# Altium schematic sheet ASIC_2.SchDoc: Title
size A2; Date: Date; CompanyName: Integrated Micro-Electronics Bulgaria; Organization: Design & Development Department; Address1: Drawing Type; Address2: Address 1; Address3: Address 2; Address4: Address 3; DocumentNumber: 730xxx; Revision: 01; SheetNumber: 1; SheetTotal: 1; PageSetup: Record=PageOptions|CenterHorizontal=True|CenterVertical=True|PrintScale=0.70|XCorrection=1.00|YCorrection=1.00|PrintKind=2|BorderSize=5000000|LeftOffset=0|BottomOffset=0|Orientation=2|PaperLength=1000|PaperWidth=1000|Scale=100|PaperSource=7|PrintQuality=-4|MediaType=1|DitherType=10|PaperKind=A4|PrintScaleMode=1; SheetSize: A3; Time: Time; ModifiedDate: Mod. Date
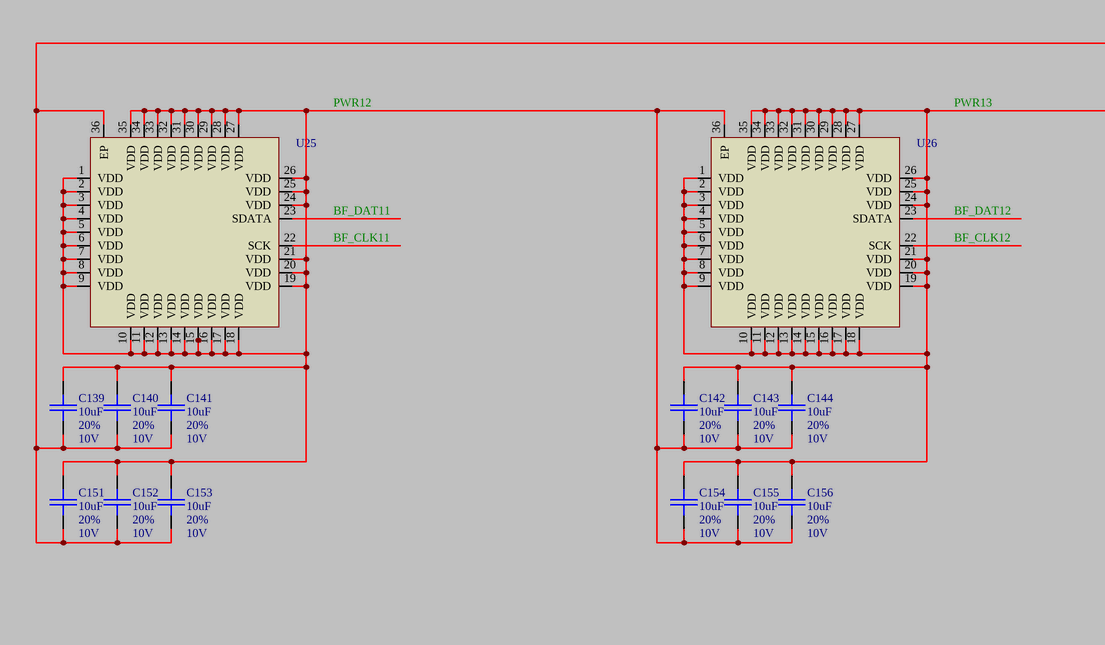
[diagram p0: ASIC_2.SchDoc, left]
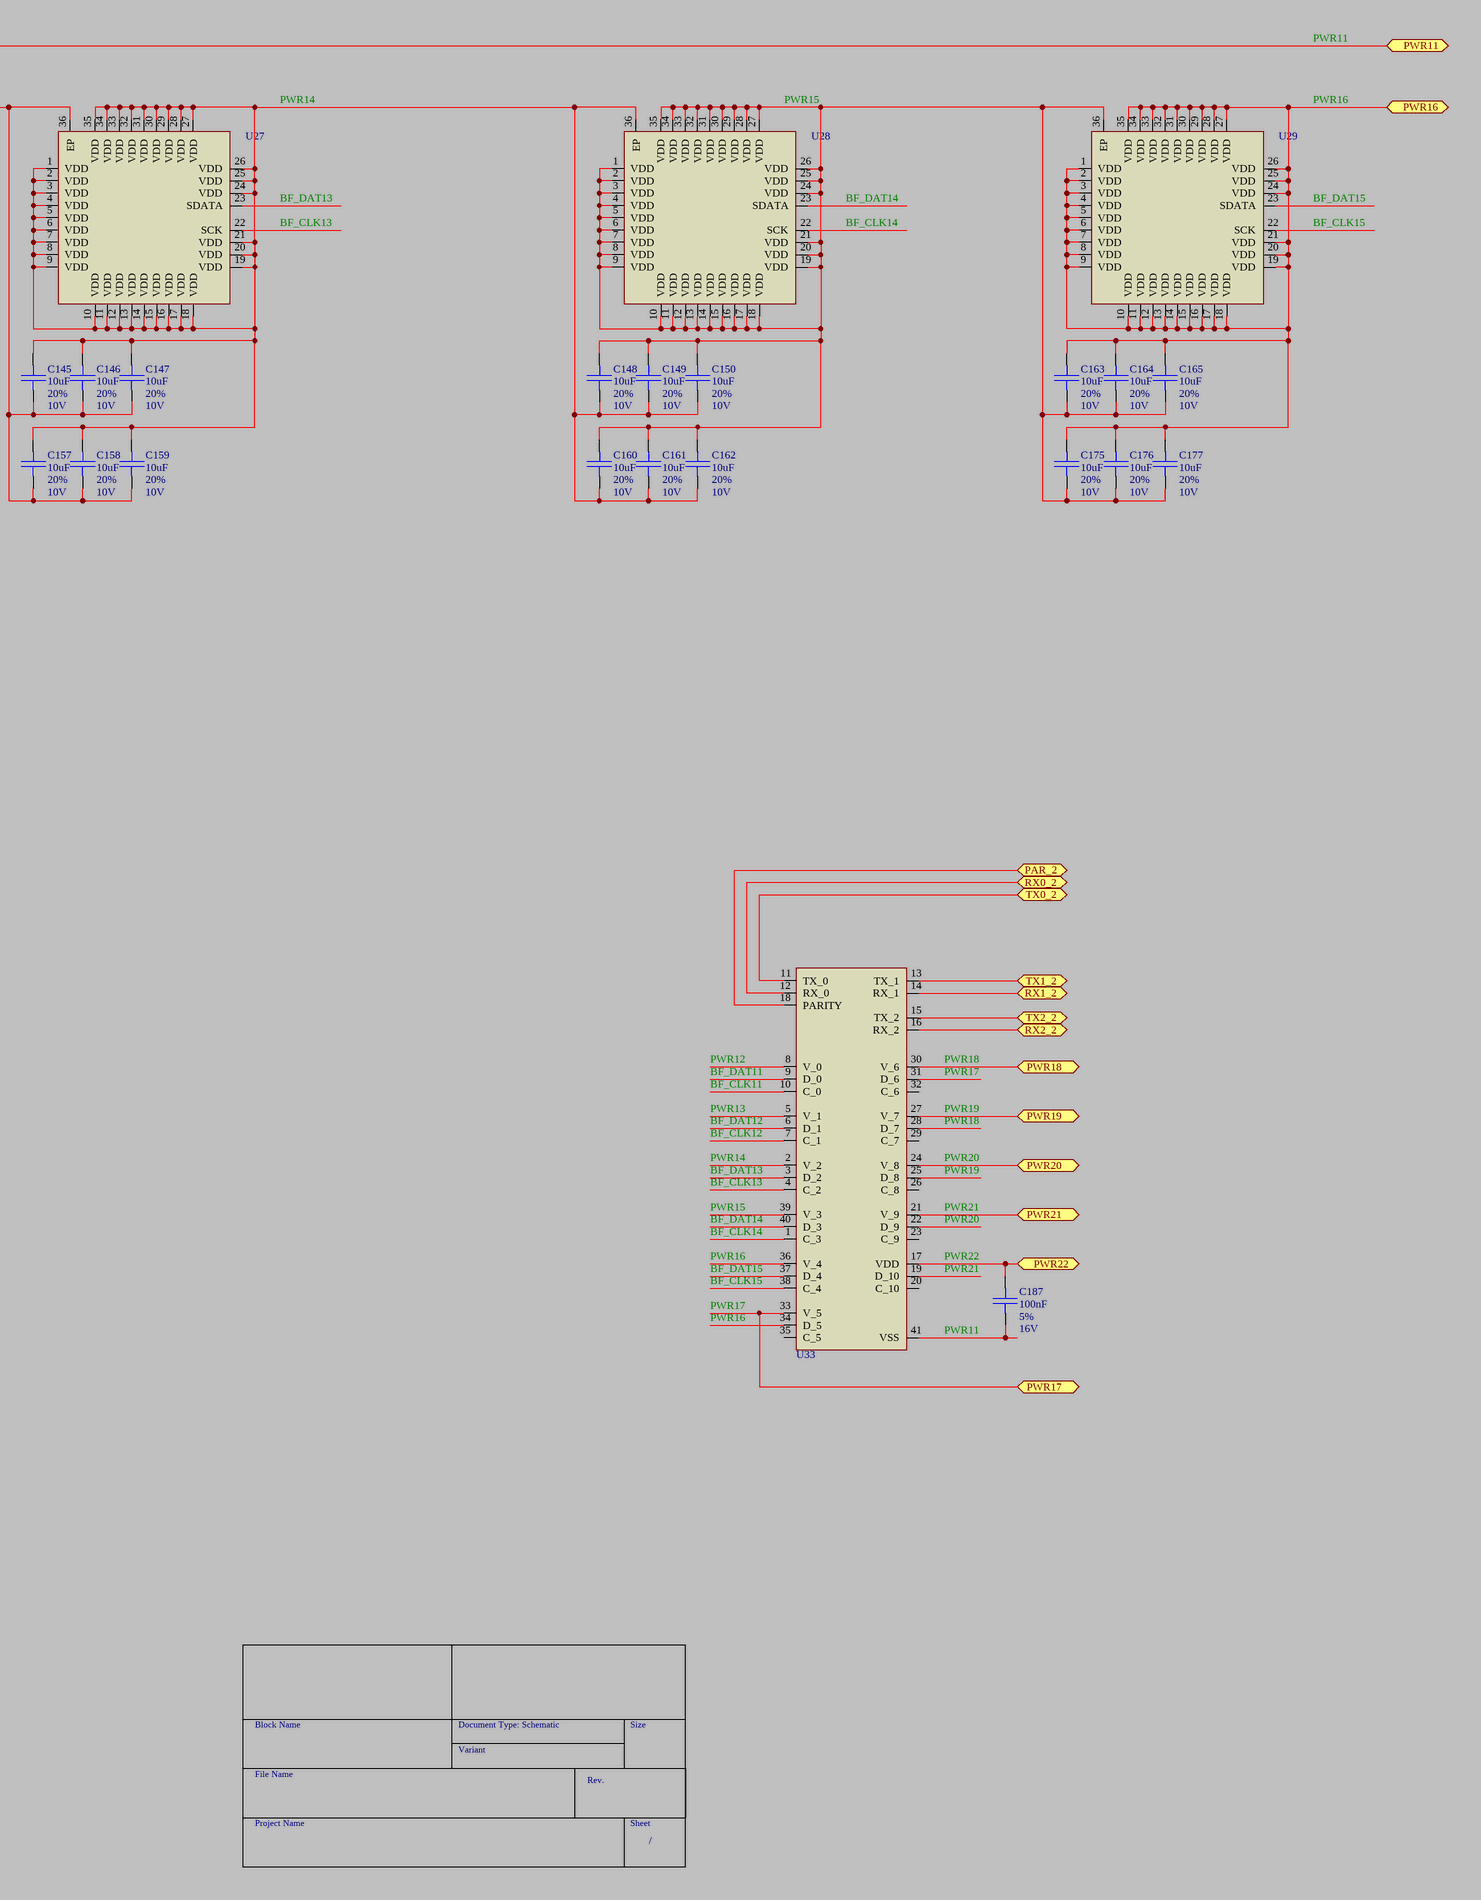
[diagram p1: ASIC_2.SchDoc, right]

## Parts
C139  DB_VALUE: 10uF  DB_TOLERANCE: 20%  DB_VOLTAGE: 10V  [SMD_0402_CAPC1005X70N]  (hidden comment: C)
C140  DB_VALUE: 10uF  DB_TOLERANCE: 20%  DB_VOLTAGE: 10V  [SMD_0402_CAPC1005X70N]  (hidden comment: C)
C141  DB_VALUE: 10uF  DB_TOLERANCE: 20%  DB_VOLTAGE: 10V  [SMD_0402_CAPC1005X70N]  (hidden comment: C)
C142  DB_VALUE: 10uF  DB_TOLERANCE: 20%  DB_VOLTAGE: 10V  [SMD_0402_CAPC1005X70N]  (hidden comment: C)
C143  DB_VALUE: 10uF  DB_TOLERANCE: 20%  DB_VOLTAGE: 10V  [SMD_0402_CAPC1005X70N]  (hidden comment: C)
C144  DB_VALUE: 10uF  DB_TOLERANCE: 20%  DB_VOLTAGE: 10V  [SMD_0402_CAPC1005X70N]  (hidden comment: C)
C145  DB_VALUE: 10uF  DB_TOLERANCE: 20%  DB_VOLTAGE: 10V  [SMD_0402_CAPC1005X70N]  (hidden comment: C)
C146  DB_VALUE: 10uF  DB_TOLERANCE: 20%  DB_VOLTAGE: 10V  [SMD_0402_CAPC1005X70N]  (hidden comment: C)
C147  DB_VALUE: 10uF  DB_TOLERANCE: 20%  DB_VOLTAGE: 10V  [SMD_0402_CAPC1005X70N]  (hidden comment: C)
C148  DB_VALUE: 10uF  DB_TOLERANCE: 20%  DB_VOLTAGE: 10V  [SMD_0402_CAPC1005X70N]  (hidden comment: C)
C149  DB_VALUE: 10uF  DB_TOLERANCE: 20%  DB_VOLTAGE: 10V  [SMD_0402_CAPC1005X70N]  (hidden comment: C)
C150  DB_VALUE: 10uF  DB_TOLERANCE: 20%  DB_VOLTAGE: 10V  [SMD_0402_CAPC1005X70N]  (hidden comment: C)
C151  DB_VALUE: 10uF  DB_TOLERANCE: 20%  DB_VOLTAGE: 10V  [SMD_0402_CAPC1005X70N]  (hidden comment: C)
C152  DB_VALUE: 10uF  DB_TOLERANCE: 20%  DB_VOLTAGE: 10V  [SMD_0402_CAPC1005X70N]  (hidden comment: C)
C153  DB_VALUE: 10uF  DB_TOLERANCE: 20%  DB_VOLTAGE: 10V  [SMD_0402_CAPC1005X70N]  (hidden comment: C)
C154  DB_VALUE: 10uF  DB_TOLERANCE: 20%  DB_VOLTAGE: 10V  [SMD_0402_CAPC1005X70N]  (hidden comment: C)
C155  DB_VALUE: 10uF  DB_TOLERANCE: 20%  DB_VOLTAGE: 10V  [SMD_0402_CAPC1005X70N]  (hidden comment: C)
C156  DB_VALUE: 10uF  DB_TOLERANCE: 20%  DB_VOLTAGE: 10V  [SMD_0402_CAPC1005X70N]  (hidden comment: C)
C157  DB_VALUE: 10uF  DB_TOLERANCE: 20%  DB_VOLTAGE: 10V  [SMD_0402_CAPC1005X70N]  (hidden comment: C)
C158  DB_VALUE: 10uF  DB_TOLERANCE: 20%  DB_VOLTAGE: 10V  [SMD_0402_CAPC1005X70N]  (hidden comment: C)
C159  DB_VALUE: 10uF  DB_TOLERANCE: 20%  DB_VOLTAGE: 10V  [SMD_0402_CAPC1005X70N]  (hidden comment: C)
C160  DB_VALUE: 10uF  DB_TOLERANCE: 20%  DB_VOLTAGE: 10V  [SMD_0402_CAPC1005X70N]  (hidden comment: C)
C161  DB_VALUE: 10uF  DB_TOLERANCE: 20%  DB_VOLTAGE: 10V  [SMD_0402_CAPC1005X70N]  (hidden comment: C)
C162  DB_VALUE: 10uF  DB_TOLERANCE: 20%  DB_VOLTAGE: 10V  [SMD_0402_CAPC1005X70N]  (hidden comment: C)
C163  DB_VALUE: 10uF  DB_TOLERANCE: 20%  DB_VOLTAGE: 10V  [SMD_0402_CAPC1005X70N]  (hidden comment: C)
C164  DB_VALUE: 10uF  DB_TOLERANCE: 20%  DB_VOLTAGE: 10V  [SMD_0402_CAPC1005X70N]  (hidden comment: C)
C165  DB_VALUE: 10uF  DB_TOLERANCE: 20%  DB_VOLTAGE: 10V  [SMD_0402_CAPC1005X70N]  (hidden comment: C)
C175  DB_VALUE: 10uF  DB_TOLERANCE: 20%  DB_VOLTAGE: 10V  [SMD_0402_CAPC1005X70N]  (hidden comment: C)
C176  DB_VALUE: 10uF  DB_TOLERANCE: 20%  DB_VOLTAGE: 10V  [SMD_0402_CAPC1005X70N]  (hidden comment: C)
C177  DB_VALUE: 10uF  DB_TOLERANCE: 20%  DB_VOLTAGE: 10V  [SMD_0402_CAPC1005X70N]  (hidden comment: C)
C187  DB_VALUE: 100nF  DB_TOLERANCE: 5%  DB_VOLTAGE: 16V  [SMD_0603_CAPC1608X95N]  (hidden comment: C)
U25  IC_BITFURY16  [SMD_QFN50P600X600X175-36AN]  (value not drawn)
U26  IC_BITFURY16  [SMD_QFN50P600X600X175-36AN]  (value not drawn)
U27  IC_BITFURY16  [SMD_QFN50P600X600X175-36AN]  (value not drawn)
U28  IC_BITFURY16  [SMD_QFN50P600X600X175-36AN]  (value not drawn)
U29  IC_BITFURY16  [SMD_QFN50P600X600X175-36AN]  (value not drawn)
U33  IC_BTC250  [SMD_QFN40P500X500X80-41N]  (value not drawn)

## Ports
PAR_2, PWR11, PWR16, PWR17, PWR18, PWR19, PWR20, PWR21, PWR22, RX0_2, RX1_2, RX2_2, TX0_2, TX1_2, TX2_2

## Nets
BF_CLK11: U25.22(SCK) U33.10(C_0)
BF_CLK12: U26.22(SCK) U33.7(C_1)
BF_CLK13: U27.22(SCK) U33.4(C_2)
BF_CLK14: U28.22(SCK) U33.1(C_3)
BF_CLK15: U29.22(SCK) U33.38(C_4)
BF_DAT11: U25.23(SDATA) U33.9(D_0)
BF_DAT12: U26.23(SDATA) U33.6(D_1)
BF_DAT13: U27.23(SDATA) U33.3(D_2)
BF_DAT14: U28.23(SDATA) U33.40(D_3)
BF_DAT15: U29.23(SDATA) U33.37(D_4)
PAR_2: U33.18(PARITY) ; port PAR_2
PWR11: C139.2 C140.2 C141.2 C151.2 C152.2 C153.2 C187.2 U25.36(EP) U33.41(VSS) ; port PWR11
PWR12: C139.1 C140.1 C141.1 C142.2 C143.2 C144.2 C151.1 C152.1 C153.1 C154.2 C155.2 C156.2 U25.1(VDD) U25.2(VDD) U25.3(VDD) U25.4(VDD) U25.5(VDD) U25.6(VDD) U25.7(VDD) U25.8(VDD) U25.9(VDD) U25.10(VDD) U25.11(VDD) U25.12(VDD) U25.13(VDD) U25.14(VDD) U25.15(VDD) U25.16(VDD) U25.17(VDD) U25.18(VDD) U25.19(VDD) U25.20(VDD) U25.21(VDD) U25.24(VDD) U25.25(VDD) U25.26(VDD) U25.27(VDD) U25.28(VDD) U25.29(VDD) U25.30(VDD) U25.31(VDD) U25.32(VDD) U25.33(VDD) U25.34(VDD) U25.35(VDD) U26.36(EP) U33.8(V_0)
PWR13: C142.1 C143.1 C144.1 C145.2 C146.2 C147.2 C154.1 C155.1 C156.1 C157.2 C158.2 C159.2 U26.1(VDD) U26.2(VDD) U26.3(VDD) U26.4(VDD) U26.5(VDD) U26.6(VDD) U26.7(VDD) U26.8(VDD) U26.9(VDD) U26.10(VDD) U26.11(VDD) U26.12(VDD) U26.13(VDD) U26.14(VDD) U26.15(VDD) U26.16(VDD) U26.17(VDD) U26.18(VDD) U26.19(VDD) U26.20(VDD) U26.21(VDD) U26.24(VDD) U26.25(VDD) U26.26(VDD) U26.27(VDD) U26.28(VDD) U26.29(VDD) U26.30(VDD) U26.31(VDD) U26.32(VDD) U26.33(VDD) U26.34(VDD) U26.35(VDD) U27.36(EP) U33.5(V_1)
PWR14: C145.1 C146.1 C147.1 C148.2 C149.2 C150.2 C157.1 C158.1 C159.1 C160.2 C161.2 C162.2 U27.1(VDD) U27.2(VDD) U27.3(VDD) U27.4(VDD) U27.5(VDD) U27.6(VDD) U27.7(VDD) U27.8(VDD) U27.9(VDD) U27.10(VDD) U27.11(VDD) U27.12(VDD) U27.13(VDD) U27.14(VDD) U27.15(VDD) U27.16(VDD) U27.17(VDD) U27.18(VDD) U27.19(VDD) U27.20(VDD) U27.21(VDD) U27.24(VDD) U27.25(VDD) U27.26(VDD) U27.27(VDD) U27.28(VDD) U27.29(VDD) U27.30(VDD) U27.31(VDD) U27.32(VDD) U27.33(VDD) U27.34(VDD) U27.35(VDD) U28.36(EP) U33.2(V_2)
PWR15: C148.1 C149.1 C150.1 C160.1 C161.1 C162.1 C163.2 C164.2 C165.2 C175.2 C176.2 C177.2 U28.1(VDD) U28.2(VDD) U28.3(VDD) U28.4(VDD) U28.5(VDD) U28.6(VDD) U28.7(VDD) U28.8(VDD) U28.9(VDD) U28.10(VDD) U28.11(VDD) U28.12(VDD) U28.13(VDD) U28.14(VDD) U28.15(VDD) U28.16(VDD) U28.17(VDD) U28.18(VDD) U28.19(VDD) U28.20(VDD) U28.21(VDD) U28.24(VDD) U28.25(VDD) U28.26(VDD) U28.27(VDD) U28.28(VDD) U28.29(VDD) U28.30(VDD) U28.31(VDD) U28.32(VDD) U28.33(VDD) U28.34(VDD) U28.35(VDD) U29.36(EP) U33.39(V_3)
PWR16: C163.1 C164.1 C165.1 C175.1 C176.1 C177.1 U29.1(VDD) U29.2(VDD) U29.3(VDD) U29.4(VDD) U29.5(VDD) U29.6(VDD) U29.7(VDD) U29.8(VDD) U29.9(VDD) U29.10(VDD) U29.11(VDD) U29.12(VDD) U29.13(VDD) U29.14(VDD) U29.15(VDD) U29.16(VDD) U29.17(VDD) U29.18(VDD) U29.19(VDD) U29.20(VDD) U29.21(VDD) U29.24(VDD) U29.25(VDD) U29.26(VDD) U29.27(VDD) U29.28(VDD) U29.29(VDD) U29.30(VDD) U29.31(VDD) U29.32(VDD) U29.33(VDD) U29.34(VDD) U29.35(VDD) U33.34(D_5) U33.36(V_4) ; port PWR16
PWR17: U33.31(D_6) U33.33(V_5) ; port PWR17
PWR18: U33.28(D_7) U33.30(V_6) ; port PWR18
PWR19: U33.25(D_8) U33.27(V_7) ; port PWR19
PWR20: U33.22(D_9) U33.24(V_8) ; port PWR20
PWR21: U33.19(D_10) U33.21(V_9) ; port PWR21
PWR22: C187.1 U33.17(VDD) ; port PWR22
RX0_2: U33.12(RX_0) ; port RX0_2
RX1_2: U33.14(RX_1) ; port RX1_2
RX2_2: U33.16(RX_2) ; port RX2_2
TX0_2: U33.11(TX_0) ; port TX0_2
TX1_2: U33.13(TX_1) ; port TX1_2
TX2_2: U33.15(TX_2) ; port TX2_2

Not connected (* = marked no-connect by the designer): U33 20(C_10) 23(C_9) 26(C_8) 29(C_7) 32(C_6) 35(C_5)

## Notes on the sheet
- Block Name
- Document Type: Schematic
- Size
- File Name
- Variant
- Rev.
- Project Name
- Sheet
- /

## Library data of the parts
C139-C165 C175-C177 = CAP000047481: DB_PART_TYPE: Ceramic_SMD\Standard_X5R; DB_MANUFACTURER_PART: SAMSUNG    CL05A106MP5NUNC; NOTE: <NOTE>; DB_T_RANGE: -55 to 85; DB_PACKAGE: 0402; DB_DESCRIPTION: C X5R 10uF 20% 10V 0402; DB_APPROVED_BY: VSN; DB_STATUS: NEW; DB_PART_NUMBER: CAP000047481; DB_PCB_DEVICE: SMD_0402_CAPC1005X70N; DB_APPROVED_ON: 20.04.2016 14:32:27; DB_DATASHEET: http://john.epiqdesign.com/projects/CIS_Datasheets/CAP_S_CL05A106MP5NUNC.pdf?rev=2053&sc=0
C187 = CAP000027134: DB_PART_TYPE: Ceramic_SMD\Standard_X7R; DB_MANUFACTURER_PART: KEMET    C0603C104J4RAC; NOTE: <NOTE>; DB_T_RANGE: -55 to 125; DB_PACKAGE: 0603; DB_DESCRIPTION: C X7R 100nF 5% 16V 0603; DB_STATUS: NEW; DB_PART_NUMBER: CAP000027134; DB_PCB_DEVICE: SMD_0603_CAPC1608X95N; DB_APPROVED_ON: 09.10.2010; DB_DATASHEET: http://john.epiqdesign.com/projects/CIS_Datasheets/F3102_CE_Kemet.pdf?rev=92&sc=0
U25-U29 = IC_BITFURY16: BitFury 2016 16 nm; DB_PACKAGE: FCLGA 35L 6x6mm; DB_VALUE: BF8162C16; DB_DESCRIPTION: BitFury 2016 16 nm; DB_PCB_DEVICE: SMD_QFN50P600X600X175-36AN
U33 = IC_BTC250: DB_MANUFACTURER_PART: BTC250 QFN40 EP; DB_PACKAGE: QFN40 EP; DB_VALUE: BTC250; DB_PCB_DEVICE: SMD_QFN40P500X500X80-41N